# Altium schematic sheet Power Generation - LDO.SchDoc: [4] Power Generation - LDO
size A4; ApprovedBy: Nagy Richard; CheckedBy: Nagy Richard; Author: Nagy Richard; CompanyName: EmbedCore; DrawnBy: Nagy Richard; Engineer: Nagy Richard; Organization: EmbedCore; DocumentNumber: 5; Revision: 1.0; SheetNumber: 5; SheetTotal: 5
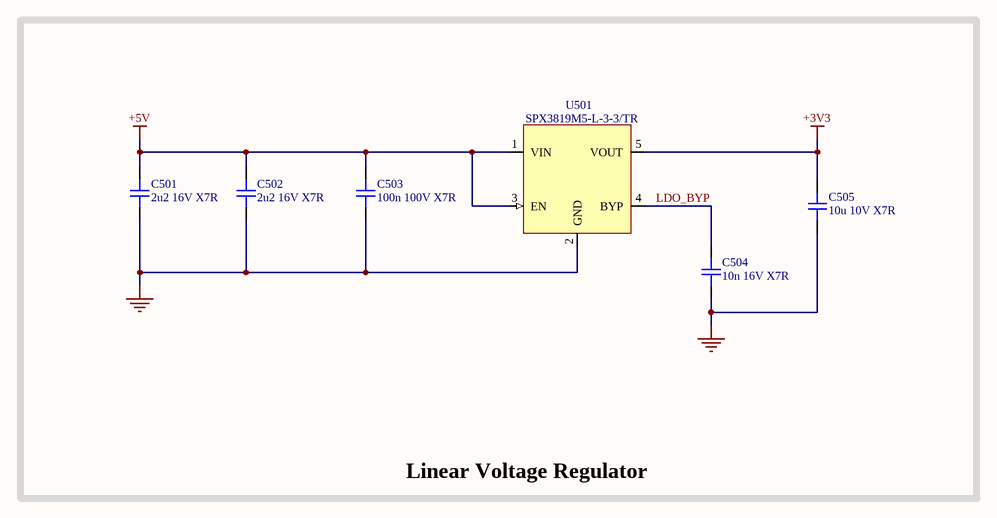
[diagram p0: Power Generation - LDO.SchDoc]

## Parts
C501  2u2 16V X7R  [CAP_0805]
C502  2u2 16V X7R  [CAP_0805]
C503  100n 100V X7R  [CAP_0805]
C504  10n 16V X7R  [CAP_0603]
C505  10u 10V X7R  [CAP_0805]
U501  SPX3819M5-L-3-3/TR  [SOT-23-5]

## Blocks framed on the sheet
Linear Voltage Regulator: C501-C505 U501

## Nets
+3V3: C505.1 U501.5(VOUT)
+5V: C501.1 C502.1 C503.1 U501.1(VIN) U501.3(EN)
GND: C501.2 C502.2 C503.2 C504.1 C505.2 U501.2(GND)
LDO_BYP: C504.2 U501.4(BYP)

## Notes on the sheet
- Title:
- Drawn By:
- Page Contents:
- Checked By:
- Size:
- Date:
- File:
- License:
- Email:
- A4
- Number:
- Time:
- Revision:
- Sheet
- Website:
- of

## Library data of the parts
C501 C502 = CAP_0805: Capacitor SMD 0805; Manufacturer: HRE; Manufacturer Part Number: CGA0805X7R225K160MT; Distributor Link: www.lcsc.com; LCSC: C6119936; Rating: *; Dielectric: *
C503 = CAP_0805: Capacitor SMD 0805; Manufacturer: YAGEO; Manufacturer Part Number: CC0805JRX7R7BB104; Distributor Link: www.lcsc.com; LCSC: CC0805JRX7R7BB104; Rating: *; Dielectric: *
C504 = CAP_0603: Capacitor SMD 0603; Manufacturer: YAGEO; Manufacturer Part Number: CC0603JRX7R7BB103; Distributor Link: www.lcsc.com; LCSC: C519509; Rating: *; Dielectric: *
C505 = CAP_0805: Capacitor SMD 0805; Manufacturer: Murata Electronics; Manufacturer Part Number: GCM21BR71A106KE22K; Distributor Link: www.lcsc.com; LCSC: C2167756; Rating: *; Dielectric: *
U501 = SPX3819M5-L-3-3/TR: 500mA +3.3V Low-Noise LDO Voltage Regulator; Manufacturer: MaxLinear; Manufacturer Part Number: SPX3819M5-L-3-3/TR